# Altium schematic sheet [07] - FPGA XCVR.SchDoc
size A3; DocumentNumber: 7; SheetNumber: 7; SheetTotal: 15
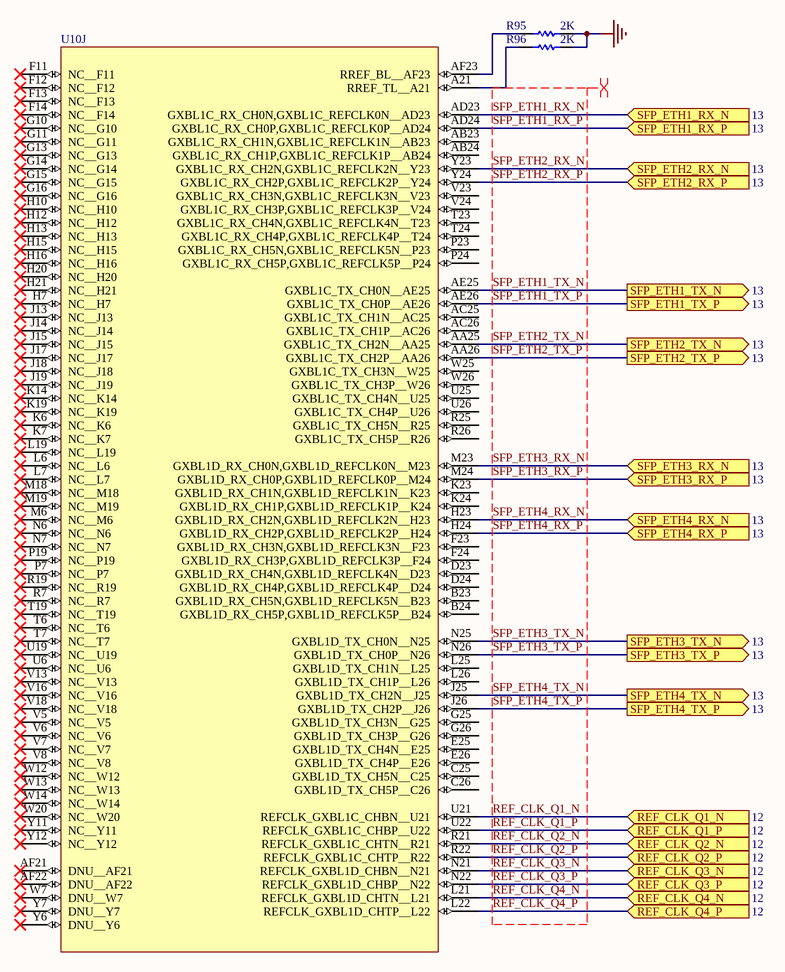
[diagram p0: [07] - FPGA XCVR.SchDoc]

## Parts
R95  2K  [0402_R]
R96  2K  [0402_R]
U10  10AX016 F27  [FBGA672]  (value not drawn)  (part J of 12)

## Ports
REF_CLK_Q1_N (in, see 12), REF_CLK_Q1_P (in, see 12), REF_CLK_Q2_N (in, see 12), REF_CLK_Q2_P (in, see 12), REF_CLK_Q3_N (in, see 12), REF_CLK_Q3_P (in, see 12), REF_CLK_Q4_N (in, see 12), REF_CLK_Q4_P (in, see 12), SFP_ETH1_RX_N (in, see 13), SFP_ETH1_RX_P (in, see 13), SFP_ETH1_TX_N (out, see 13), SFP_ETH1_TX_P (out, see 13), SFP_ETH2_RX_N (in, see 13), SFP_ETH2_RX_P (in, see 13), SFP_ETH2_TX_N (out, see 13), SFP_ETH2_TX_P (out, see 13), SFP_ETH3_RX_N (in, see 13), SFP_ETH3_RX_P (in, see 13), SFP_ETH3_TX_N (out, see 13), SFP_ETH3_TX_P (out, see 13), SFP_ETH4_RX_N (in, see 13), SFP_ETH4_RX_P (in, see 13), SFP_ETH4_TX_N (out, see 13), SFP_ETH4_TX_P (out, see 13)

## Nets
GND: R95.2 R96.2
REF_CLK_Q1_N: U10.U21(REFCLK_GXBL1C_CHBN__U21) ; port REF_CLK_Q1_N
REF_CLK_Q1_P: U10.U22(REFCLK_GXBL1C_CHBP__U22) ; port REF_CLK_Q1_P
REF_CLK_Q2_N: U10.R21(REFCLK_GXBL1C_CHTN__R21) ; port REF_CLK_Q2_N
REF_CLK_Q2_P: U10.R22(REFCLK_GXBL1C_CHTP__R22) ; port REF_CLK_Q2_P
REF_CLK_Q3_N: U10.N21(REFCLK_GXBL1D_CHBN__N21) ; port REF_CLK_Q3_N
REF_CLK_Q3_P: U10.N22(REFCLK_GXBL1D_CHBP__N22) ; port REF_CLK_Q3_P
REF_CLK_Q4_N: U10.L21(REFCLK_GXBL1D_CHTN__L21) ; port REF_CLK_Q4_N
REF_CLK_Q4_P: U10.L22(REFCLK_GXBL1D_CHTP__L22) ; port REF_CLK_Q4_P
SFP_ETH1_RX_N: U10.AD23(GXBL1C_RX_CH0N,GXBL1C_REFCLK0N__AD23) ; port SFP_ETH1_RX_N
SFP_ETH1_RX_P: U10.AD24(GXBL1C_RX_CH0P,GXBL1C_REFCLK0P__AD24) ; port SFP_ETH1_RX_P
SFP_ETH1_TX_N: U10.AE25(GXBL1C_TX_CH0N__AE25) ; port SFP_ETH1_TX_N
SFP_ETH1_TX_P: U10.AE26(GXBL1C_TX_CH0P__AE26) ; port SFP_ETH1_TX_P
SFP_ETH2_RX_N: U10.Y23(GXBL1C_RX_CH2N,GXBL1C_REFCLK2N__Y23) ; port SFP_ETH2_RX_N
SFP_ETH2_RX_P: U10.Y24(GXBL1C_RX_CH2P,GXBL1C_REFCLK2P__Y24) ; port SFP_ETH2_RX_P
SFP_ETH2_TX_N: U10.AA25(GXBL1C_TX_CH2N__AA25) ; port SFP_ETH2_TX_N
SFP_ETH2_TX_P: U10.AA26(GXBL1C_TX_CH2P__AA26) ; port SFP_ETH2_TX_P
SFP_ETH3_RX_N: U10.M23(GXBL1D_RX_CH0N,GXBL1D_REFCLK0N__M23) ; port SFP_ETH3_RX_N
SFP_ETH3_RX_P: U10.M24(GXBL1D_RX_CH0P,GXBL1D_REFCLK0P__M24) ; port SFP_ETH3_RX_P
SFP_ETH3_TX_N: U10.N25(GXBL1D_TX_CH0N__N25) ; port SFP_ETH3_TX_N
SFP_ETH3_TX_P: U10.N26(GXBL1D_TX_CH0P__N26) ; port SFP_ETH3_TX_P
SFP_ETH4_RX_N: U10.H23(GXBL1D_RX_CH2N,GXBL1D_REFCLK2N__H23) ; port SFP_ETH4_RX_N
SFP_ETH4_RX_P: U10.H24(GXBL1D_RX_CH2P,GXBL1D_REFCLK2P__H24) ; port SFP_ETH4_RX_P
SFP_ETH4_TX_N: U10.J25(GXBL1D_TX_CH2N__J25) ; port SFP_ETH4_TX_N
SFP_ETH4_TX_P: U10.J26(GXBL1D_TX_CH2P__J26) ; port SFP_ETH4_TX_P
NetR95_1: R95.1 U10.AF23(RREF_BL__AF23)
NetR96_1: R96.1 U10.A21(RREF_TL__A21)

Not connected (* = marked no-connect by the designer): U10 AB23(GXBL1C_RX_CH1N,GXBL1C_REFCLK1N__AB23) AB24(GXBL1C_RX_CH1P,GXBL1C_REFCLK1P__AB24) AC25(GXBL1C_TX_CH1N__AC25) AC26(GXBL1C_TX_CH1P__AC26) AF21(DNU__AF21)* AF22(DNU__AF22)* B23(GXBL1D_RX_CH5N,GXBL1D_REFCLK5N__B23) B24(GXBL1D_RX_CH5P,GXBL1D_REFCLK5P__B24) C25(GXBL1D_TX_CH5N__C25) C26(GXBL1D_TX_CH5P__C26) D23(GXBL1D_RX_CH4N,GXBL1D_REFCLK4N__D23) D24(GXBL1D_RX_CH4P,GXBL1D_REFCLK4P__D24) E25(GXBL1D_TX_CH4N__E25) E26(GXBL1D_TX_CH4P__E26) F11(NC__F11)* F12(NC__F12)* F13(NC__F13)* F14(NC__F14)* F23(GXBL1D_RX_CH3N,GXBL1D_REFCLK3N__F23) F24(GXBL1D_RX_CH3P,GXBL1D_REFCLK3P__F24) G10(NC__G10)* G11(NC__G11)* G13(NC__G13)* G14(NC__G14)* G15(NC__G15)* G16(NC__G16)* G25(GXBL1D_TX_CH3N__G25) G26(GXBL1D_TX_CH3P__G26) H7(NC__H7)* H10(NC__H10)* H12(NC__H12)* H13(NC__H13)* H15(NC__H15)* H16(NC__H16)* H20(NC__H20)* H21(NC__H21)* J13(NC__J13)* J14(NC__J14)* J15(NC__J15)* J17(NC__J17)* J18(NC__J18)* J19(NC__J19)* K6(NC__K6)* K7(NC__K7)* K14(NC__K14)* K19(NC__K19)* K23(GXBL1D_RX_CH1N,GXBL1D_REFCLK1N__K23) K24(GXBL1D_RX_CH1P,GXBL1D_REFCLK1P__K24) L6(NC__L6)* L7(NC__L7)* L19(NC__L19)* L25(GXBL1D_TX_CH1N__L25) L26(GXBL1D_TX_CH1P__L26) M6(NC__M6)* M18(NC__M18)* M19(NC__M19)* N6(NC__N6)* N7(NC__N7)* P7(NC__P7)* P19(NC__P19)* P23(GXBL1C_RX_CH5N,GXBL1C_REFCLK5N__P23) P24(GXBL1C_RX_CH5P,GXBL1C_REFCLK5P__P24) R7(NC__R7)* R19(NC__R19)* R25(GXBL1C_TX_CH5N__R25) R26(GXBL1C_TX_CH5P__R26) T6(NC__T6)* T7(NC__T7)* T19(NC__T19)* T23(GXBL1C_RX_CH4N,GXBL1C_REFCLK4N__T23) T24(GXBL1C_RX_CH4P,GXBL1C_REFCLK4P__T24) U6(NC__U6)* U19(NC__U19)* U25(GXBL1C_TX_CH4N__U25) U26(GXBL1C_TX_CH4P__U26) V5(NC__V5)* V6(NC__V6)* V7(NC__V7)* V8(NC__V8)* V13(NC__V13)* V16(NC__V16)* V18(NC__V18)* V23(GXBL1C_RX_CH3N,GXBL1C_REFCLK3N__V23) V24(GXBL1C_RX_CH3P,GXBL1C_REFCLK3P__V24) W7(DNU__W7)* W12(NC__W12)* W13(NC__W13)* W14(NC__W14)* W20(NC__W20)* W25(GXBL1C_TX_CH3N__W25) W26(GXBL1C_TX_CH3P__W26) Y6(DNU__Y6)* Y7(DNU__Y7)* Y11(NC__Y11)* Y12(NC__Y12)*

## Layout directives
differential pair; differential pair class DIFF100: REF_CLK_Q1_N, REF_CLK_Q1_P, REF_CLK_Q2_N, REF_CLK_Q2_P, REF_CLK_Q3_N, REF_CLK_Q3_P, REF_CLK_Q4_N, REF_CLK_Q4_P, SFP_ETH1_RX_N, SFP_ETH1_RX_P, SFP_ETH1_TX_N, SFP_ETH1_TX_P, SFP_ETH2_RX_N, SFP_ETH2_RX_P, SFP_ETH2_TX_N, SFP_ETH2_TX_P, SFP_ETH3_RX_N, SFP_ETH3_RX_P, SFP_ETH3_TX_N, SFP_ETH3_TX_P, SFP_ETH4_RX_N, SFP_ETH4_RX_P, SFP_ETH4_TX_N, SFP_ETH4_TX_P

## Library data of the parts
R95 R96 = Res SMD: SMD Resistor; Tolerance: 1%; Value: 2K; Manufacturer Part Num: *
U10 = 10AX016: Value: 10AX016 F27; Manufacturer Part Num: *